# EAGLE schematic ECU-V1.3 (EAGLE 7.6.0)

## Sheet 1 of 6
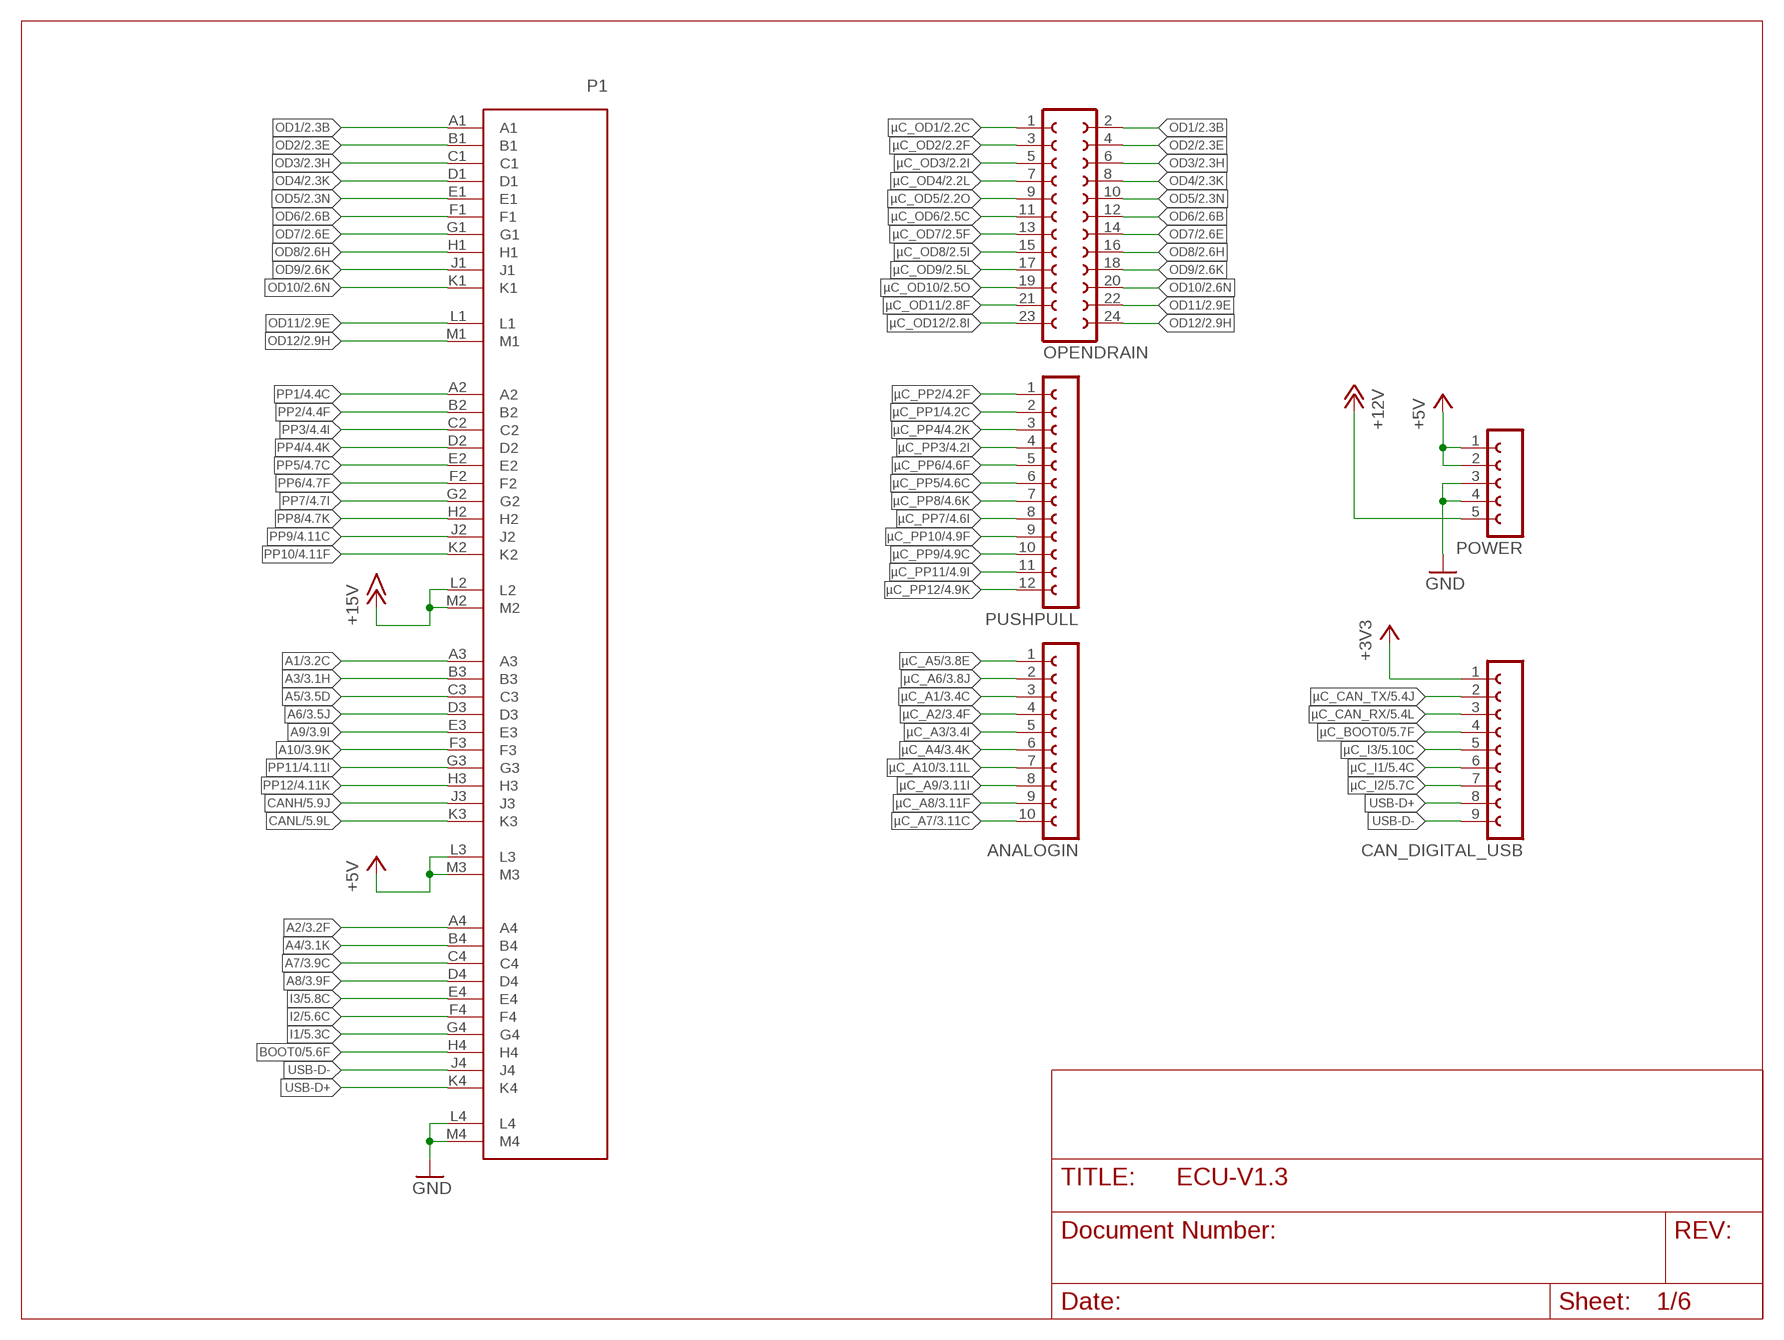
[diagram p0: schematic, sheet 1]

### Parts
ANALOGIN  FE10-1  [FE10]
CAN_DIGITAL_USB  FE09-1  [FE09]
OPENDRAIN  FE12-2  [FE12-2]
P1  ECU-CONNECTOR  [ECU-CONNECTOR]
POWER  FE05-1  [FE05-1]
PUSHPULL  FE12-1  [FE12]

### Nets
+3V3: CAN_DIGITAL_USB.1 ; also sheet 5
+5V: P1.L3 P1.M3 POWER.1 POWER.2 ; also sheet 3,4,5,6
+12V: POWER.5 ; also sheet 3,6
+15V: P1.L2 P1.M2 ; also sheet 6
A1: P1.A3 ; also sheet 3
A2: P1.A4 ; also sheet 3
A3: P1.B3 ; also sheet 3
A4: P1.B4 ; also sheet 3
A5: P1.C3 ; also sheet 3
A6: P1.D3 ; also sheet 3
A7: P1.C4 ; also sheet 3
A8: P1.D4 ; also sheet 3
A9: P1.E3 ; also sheet 3
A10: P1.F3 ; also sheet 3
BOOT0: P1.H4 ; also sheet 5
CANH: P1.J3 ; also sheet 5
CANL: P1.K3 ; also sheet 5
GND: P1.L4 P1.M4 POWER.3 POWER.4 ; also sheet 2,3,4,5,6
I1: P1.G4 ; also sheet 5
I2: P1.F4 ; also sheet 5
I3: P1.E4 ; also sheet 5
OD1: OPENDRAIN.2 P1.A1 ; also sheet 2
OD2: OPENDRAIN.4 P1.B1 ; also sheet 2
OD3: OPENDRAIN.6 P1.C1 ; also sheet 2
OD4: OPENDRAIN.8 P1.D1 ; also sheet 2
OD5: OPENDRAIN.10 P1.E1 ; also sheet 2
OD6: OPENDRAIN.12 P1.F1 ; also sheet 2
OD7: OPENDRAIN.14 P1.G1 ; also sheet 2
OD8: OPENDRAIN.16 P1.H1 ; also sheet 2
OD9: OPENDRAIN.18 P1.J1 ; also sheet 2
OD10: OPENDRAIN.20 P1.K1 ; also sheet 2
OD11: OPENDRAIN.22 P1.L1 ; also sheet 2
OD12: OPENDRAIN.24 P1.M1 ; also sheet 2
PP1: P1.A2 ; also sheet 4
PP2: P1.B2 ; also sheet 4
PP3: P1.C2 ; also sheet 4
PP4: P1.D2 ; also sheet 4
PP5: P1.E2 ; also sheet 4
PP6: P1.F2 ; also sheet 4
PP7: P1.G2 ; also sheet 4
PP8: P1.H2 ; also sheet 4
PP9: P1.J2 ; also sheet 4
PP10: P1.K2 ; also sheet 4
PP11: P1.G3 ; also sheet 4
PP12: P1.H3 ; also sheet 4
USB-D+: CAN_DIGITAL_USB.8 P1.K4
USB-D-: CAN_DIGITAL_USB.9 P1.J4
µC_A1: ANALOGIN.3 ; also sheet 3
µC_A2: ANALOGIN.4 ; also sheet 3
µC_A3: ANALOGIN.5 ; also sheet 3
µC_A4: ANALOGIN.6 ; also sheet 3
µC_A5: ANALOGIN.1 ; also sheet 3
µC_A6: ANALOGIN.2 ; also sheet 3
µC_A7: ANALOGIN.10 ; also sheet 3
µC_A8: ANALOGIN.9 ; also sheet 3
µC_A9: ANALOGIN.8 ; also sheet 3
µC_A10: ANALOGIN.7 ; also sheet 3
µC_BOOT0: CAN_DIGITAL_USB.4 ; also sheet 5
µC_CAN_RX: CAN_DIGITAL_USB.3 ; also sheet 5
µC_CAN_TX: CAN_DIGITAL_USB.2 ; also sheet 5
µC_I1: CAN_DIGITAL_USB.6 ; also sheet 5
µC_I2: CAN_DIGITAL_USB.7 ; also sheet 5
µC_I3: CAN_DIGITAL_USB.5 ; also sheet 5
µC_OD1: OPENDRAIN.1 ; also sheet 2
µC_OD2: OPENDRAIN.3 ; also sheet 2
µC_OD3: OPENDRAIN.5 ; also sheet 2
µC_OD4: OPENDRAIN.7 ; also sheet 2
µC_OD5: OPENDRAIN.9 ; also sheet 2
µC_OD6: OPENDRAIN.11 ; also sheet 2
µC_OD7: OPENDRAIN.13 ; also sheet 2
µC_OD8: OPENDRAIN.15 ; also sheet 2
µC_OD9: OPENDRAIN.17 ; also sheet 2
µC_OD10: OPENDRAIN.19 ; also sheet 2
µC_OD11: OPENDRAIN.21 ; also sheet 2
µC_OD12: OPENDRAIN.23 ; also sheet 2
µC_PP1: PUSHPULL.2 ; also sheet 4
µC_PP2: PUSHPULL.1 ; also sheet 4
µC_PP3: PUSHPULL.4 ; also sheet 4
µC_PP4: PUSHPULL.3 ; also sheet 4
µC_PP5: PUSHPULL.6 ; also sheet 4
µC_PP6: PUSHPULL.5 ; also sheet 4
µC_PP7: PUSHPULL.8 ; also sheet 4
µC_PP8: PUSHPULL.7 ; also sheet 4
µC_PP9: PUSHPULL.10 ; also sheet 4
µC_PP10: PUSHPULL.9 ; also sheet 4
µC_PP11: PUSHPULL.11 ; also sheet 4
µC_PP12: PUSHPULL.12 ; also sheet 4

## Sheet 2 of 6
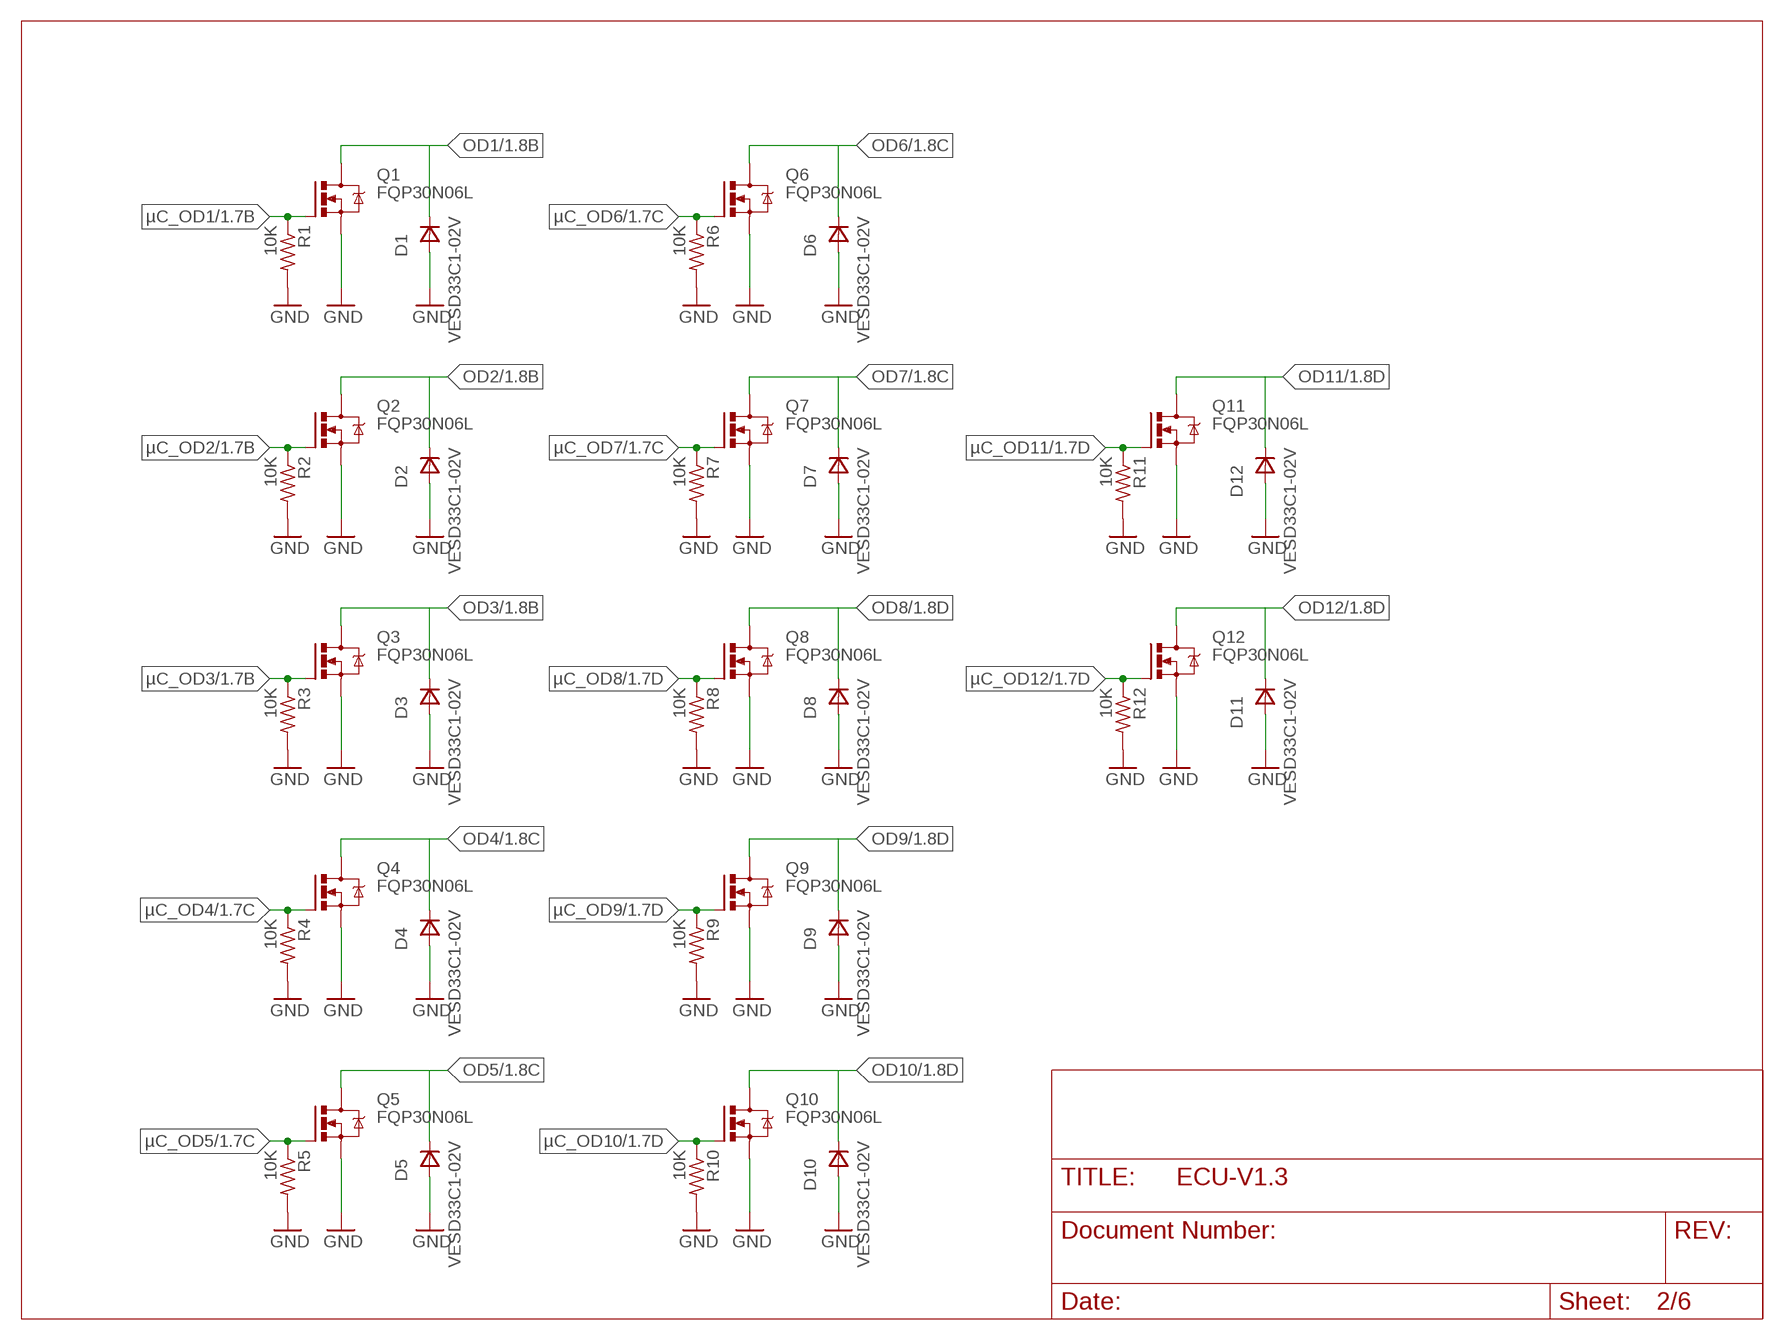
[diagram p1: schematic, sheet 2]

### Parts
D1  VESD33C1-02V  DSOD323  [SOD323]
D2  VESD33C1-02V  DSOD323  [SOD323]
D3  VESD33C1-02V  DSOD323  [SOD323]
D4  VESD33C1-02V  DSOD323  [SOD323]
D5  VESD33C1-02V  DSOD323  [SOD323]
D6  VESD33C1-02V  DSOD323  [SOD323]
D7  VESD33C1-02V  DSOD323  [SOD323]
D8  VESD33C1-02V  DSOD323  [SOD323]
D9  VESD33C1-02V  DSOD323  [SOD323]
D10  VESD33C1-02V  DSOD323  [SOD323]
D11  VESD33C1-02V  DSOD323  [SOD323]
D12  VESD33C1-02V  DSOD323  [SOD323]
Q1  FQP30N06L  [TO220BV]
Q2  FQP30N06L  [TO220BV]
Q3  FQP30N06L  [TO220BV]
Q4  FQP30N06L  [TO220BV]
Q5  FQP30N06L  [TO220BV]
Q6  FQP30N06L  [TO220BV]
Q7  FQP30N06L  [TO220BV]
Q8  FQP30N06L  [TO220BV]
Q9  FQP30N06L  [TO220BV]
Q10  FQP30N06L  [TO220BV]
Q11  FQP30N06L  [TO220BV]
Q12  FQP30N06L  [TO220BV]
R1  10K  R-US_R0805  [R0805]
R2  10K  R-US_R0805  [R0805]
R3  10K  R-US_R0805  [R0805]
R4  10K  R-US_R0805  [R0805]
R5  10K  R-US_R0805  [R0805]
R6  10K  R-US_R0805  [R0805]
R7  10K  R-US_R0805  [R0805]
R8  10K  R-US_R0805  [R0805]
R9  10K  R-US_R0805  [R0805]
R10  10K  R-US_R0805  [R0805]
R11  10K  R-US_R0805  [R0805]
R12  10K  R-US_R0805  [R0805]

### Nets
GND: D1.2(A) D2.2(A) D3.2(A) D4.2(A) D5.2(A) D6.2(A) D7.2(A) D8.2(A) D9.2(A) D10.2(A) D11.2(A) D12.2(A) Q1.S Q2.S Q3.S Q4.S Q5.S Q6.S Q7.S Q8.S Q9.S Q10.S Q11.S Q12.S R1.2 R2.2 R3.2 R4.2 R5.2 R6.2 R7.2 R8.2 R9.2 R10.2 R11.2 R12.2 ; also sheet 1,3,4,5,6
OD1: D1.1(C) Q1.D ; also sheet 1
OD2: D2.1(C) Q2.D ; also sheet 1
OD3: D3.1(C) Q3.D ; also sheet 1
OD4: D4.1(C) Q4.D ; also sheet 1
OD5: D5.1(C) Q5.D ; also sheet 1
OD6: D6.1(C) Q6.D ; also sheet 1
OD7: D7.1(C) Q7.D ; also sheet 1
OD8: D8.1(C) Q8.D ; also sheet 1
OD9: D9.1(C) Q9.D ; also sheet 1
OD10: D10.1(C) Q10.D ; also sheet 1
OD11: D12.1(C) Q11.D ; also sheet 1
OD12: D11.1(C) Q12.D ; also sheet 1
µC_OD1: Q1.G R1.1 ; also sheet 1
µC_OD2: Q2.G R2.1 ; also sheet 1
µC_OD3: Q3.G R3.1 ; also sheet 1
µC_OD4: Q4.G R4.1 ; also sheet 1
µC_OD5: Q5.G R5.1 ; also sheet 1
µC_OD6: Q6.G R6.1 ; also sheet 1
µC_OD7: Q7.G R7.1 ; also sheet 1
µC_OD8: Q8.G R8.1 ; also sheet 1
µC_OD9: Q9.G R9.1 ; also sheet 1
µC_OD10: Q10.G R10.1 ; also sheet 1
µC_OD11: Q11.G R11.1 ; also sheet 1
µC_OD12: Q12.G R12.1 ; also sheet 1

## Sheet 3 of 6
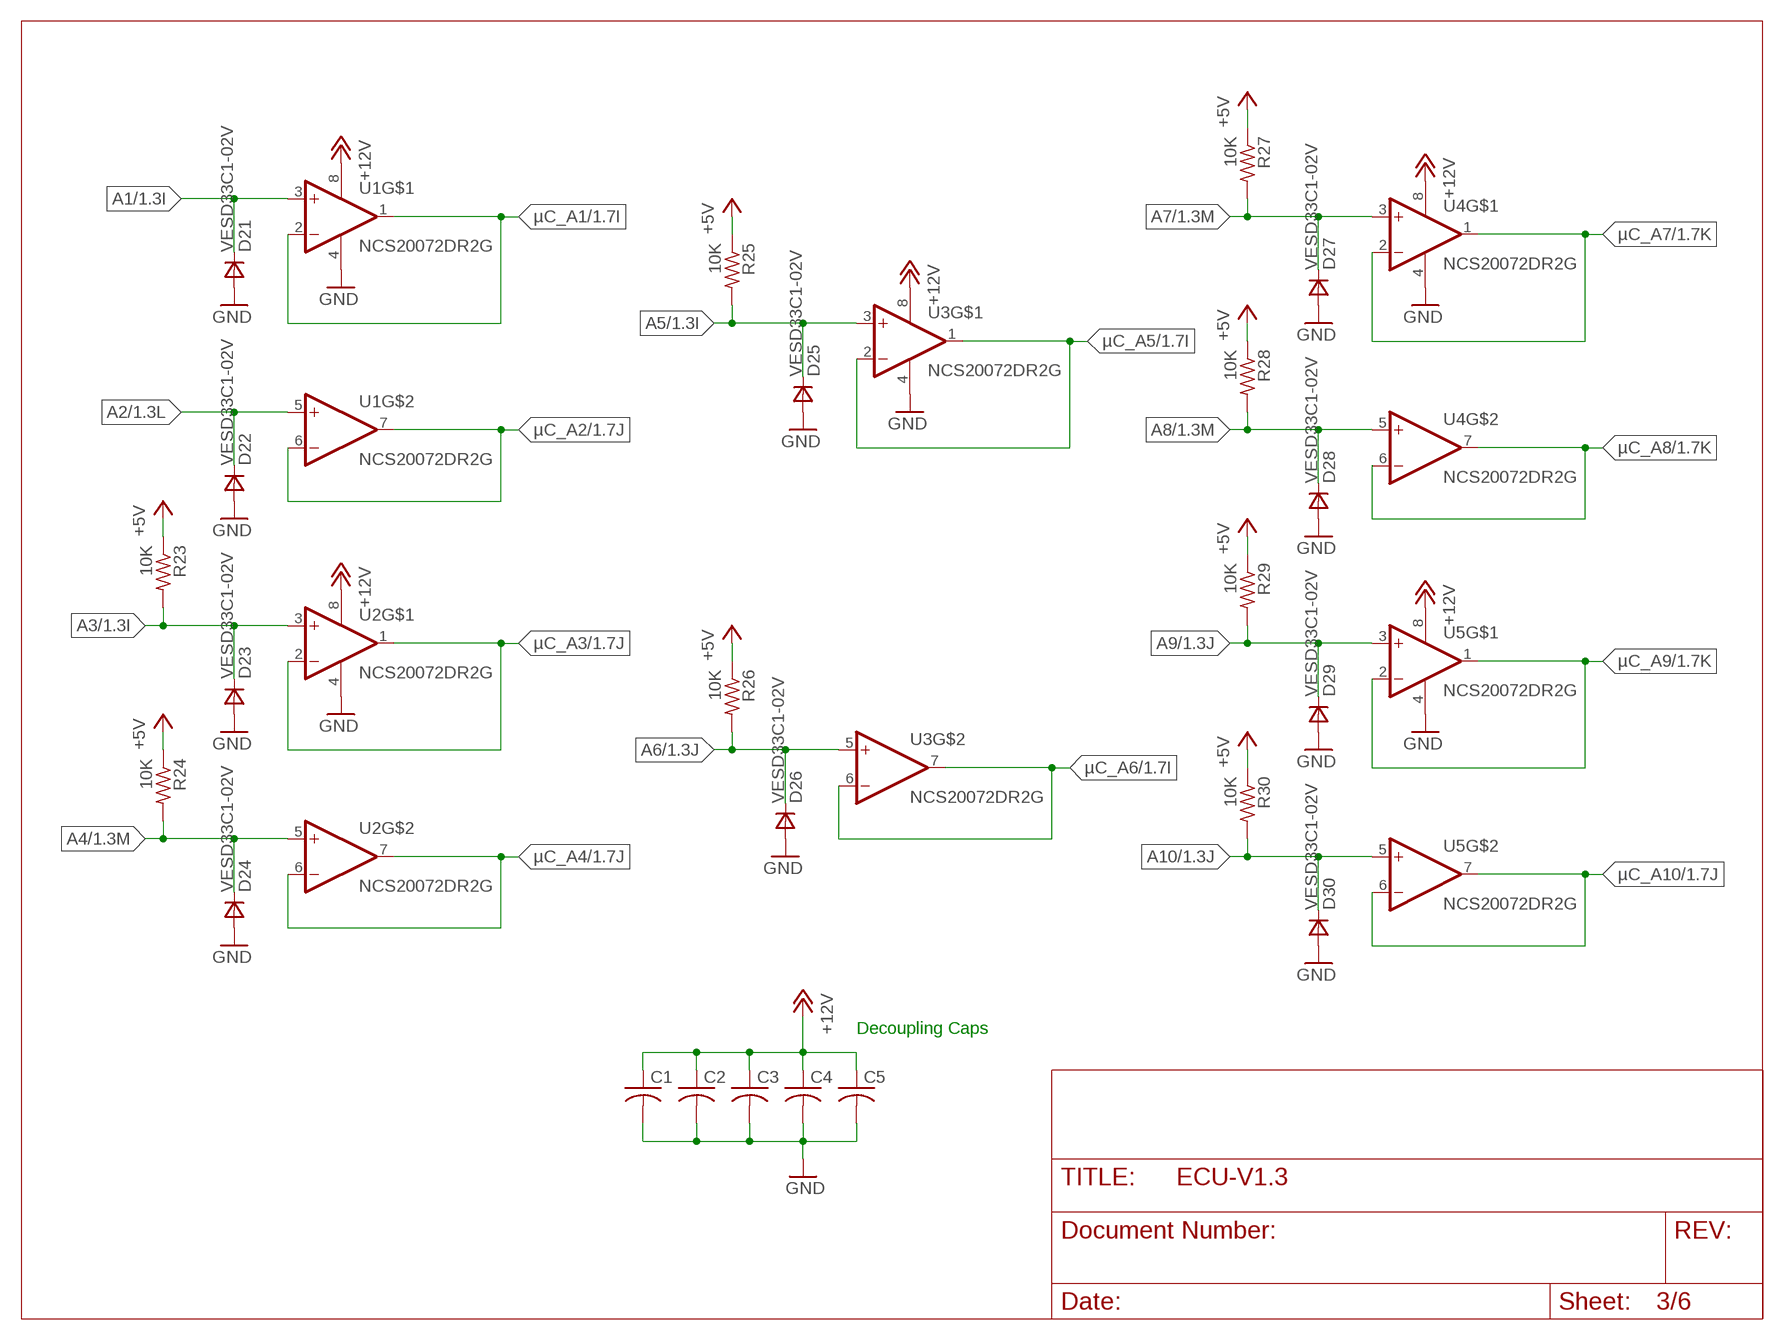
[diagram p2: schematic, sheet 3]

### Parts
C1  C-USC0805  [C0805]
C2  C-USC0805  [C0805]
C3  C-USC0805  [C0805]
C4  C-USC0805  [C0805]
C5  C-USC0805  [C0805]
D21  VESD33C1-02V  DSOD323  [SOD323]
D22  VESD33C1-02V  DSOD323  [SOD323]
D23  VESD33C1-02V  DSOD323  [SOD323]
D24  VESD33C1-02V  DSOD323  [SOD323]
D25  VESD33C1-02V  DSOD323  [SOD323]
D26  VESD33C1-02V  DSOD323  [SOD323]
D27  VESD33C1-02V  DSOD323  [SOD323]
D28  VESD33C1-02V  DSOD323  [SOD323]
D29  VESD33C1-02V  DSOD323  [SOD323]
D30  VESD33C1-02V  DSOD323  [SOD323]
R23  10K  R-US_R0805  [R0805]
R24  10K  R-US_R0805  [R0805]
R25  10K  R-US_R0805  [R0805]
R26  10K  R-US_R0805  [R0805]
R27  10K  R-US_R0805  [R0805]
R28  10K  R-US_R0805  [R0805]
R29  10K  R-US_R0805  [R0805]
R30  10K  R-US_R0805  [R0805]
U1  NCS20072DR2G  [SOIC8]
U2  NCS20072DR2G  [SOIC8]
U3  NCS20072DR2G  [SOIC8]
U4  NCS20072DR2G  [SOIC8]
U5  NCS20072DR2G  [SOIC8]

### Nets
+5V: R23.1 R24.1 R25.1 R26.1 R27.1 R28.1 R29.1 R30.1 ; also sheet 1,4,5,6
+12V: C1.1 C2.1 C3.1 C4.1 C5.1 U1.8(V+) U2.8(V+) U3.8(V+) U4.8(V+) U5.8(V+) ; also sheet 1,6
A1: D21.1(C) U1.3(+IN) ; also sheet 1
A2: D22.1(C) U1.5(+IN) ; also sheet 1
A3: D23.1(C) R23.2 U2.3(+IN) ; also sheet 1
A4: D24.1(C) R24.2 U2.5(+IN) ; also sheet 1
A5: D25.1(C) R25.2 U3.3(+IN) ; also sheet 1
A6: D26.1(C) R26.2 U3.5(+IN) ; also sheet 1
A7: D27.1(C) R27.2 U4.3(+IN) ; also sheet 1
A8: D28.1(C) R28.2 U4.5(+IN) ; also sheet 1
A9: D29.1(C) R29.2 U5.3(+IN) ; also sheet 1
A10: D30.1(C) R30.2 U5.5(+IN) ; also sheet 1
GND: C1.2 C2.2 C3.2 C4.2 C5.2 D21.2(A) D22.2(A) D23.2(A) D24.2(A) D25.2(A) D26.2(A) D27.2(A) D28.2(A) D29.2(A) D30.2(A) U1.4(V-) U2.4(V-) U3.4(V-) U4.4(V-) U5.4(V-) ; also sheet 1,2,4,5,6
µC_A1: U1.1(OUT) U1.2(-IN) ; also sheet 1
µC_A2: U1.6(-IN) U1.7(OUT) ; also sheet 1
µC_A3: U2.1(OUT) U2.2(-IN) ; also sheet 1
µC_A4: U2.6(-IN) U2.7(OUT) ; also sheet 1
µC_A5: U3.1(OUT) U3.2(-IN) ; also sheet 1
µC_A6: U3.6(-IN) U3.7(OUT) ; also sheet 1
µC_A7: U4.1(OUT) U4.2(-IN) ; also sheet 1
µC_A8: U4.6(-IN) U4.7(OUT) ; also sheet 1
µC_A9: U5.1(OUT) U5.2(-IN) ; also sheet 1
µC_A10: U5.6(-IN) U5.7(OUT) ; also sheet 1

### Notes on the sheet
- Decoupling Caps

## Sheet 4 of 6
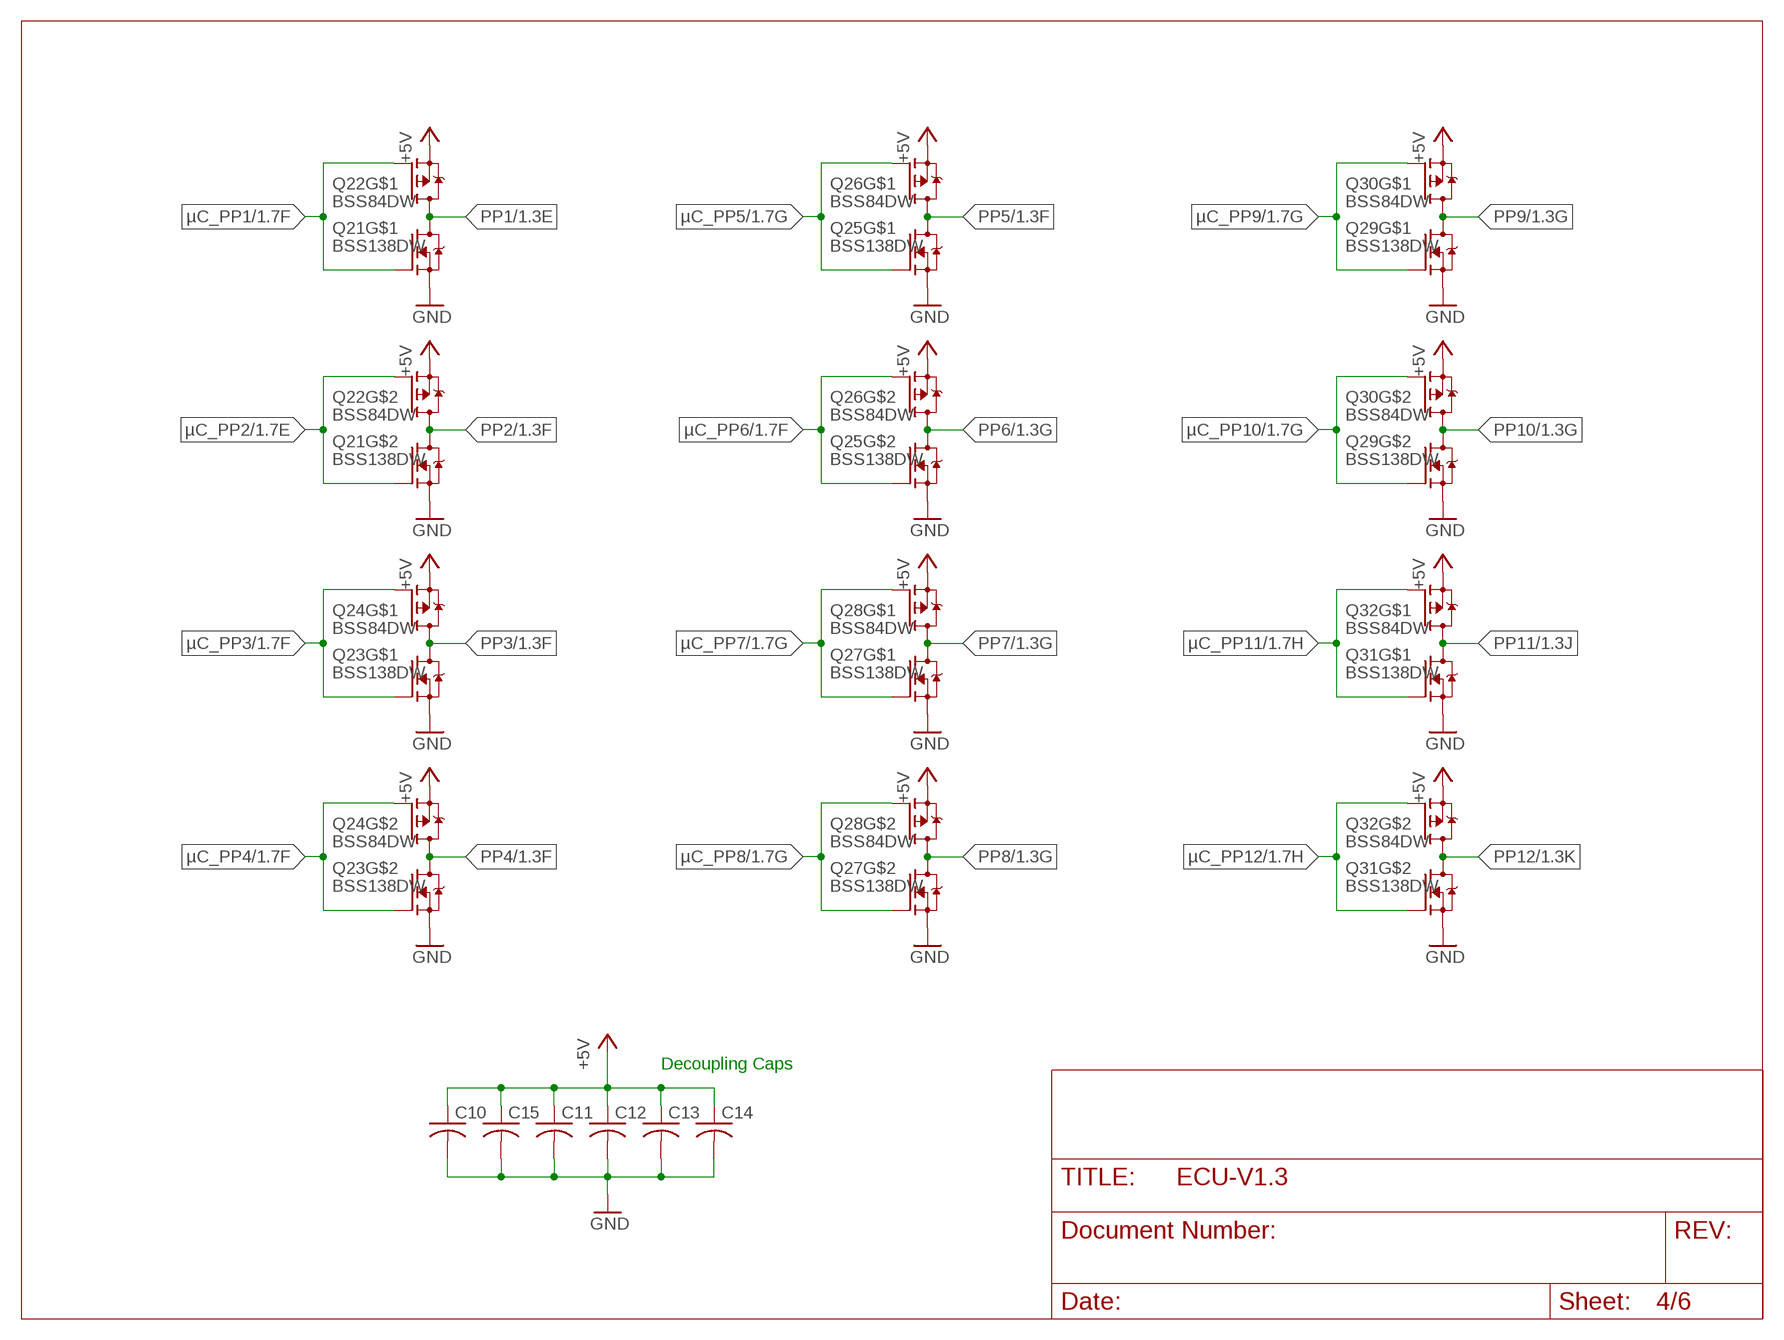
[diagram p3: schematic, sheet 4]

### Parts
C10  C-USC0805  [C0805]
C11  C-USC0805  [C0805]
C12  C-USC0805  [C0805]
C13  C-USC0805  [C0805]
C14  C-USC0805  [C0805]
C15  C-USC0805  [C0805]
Q21  BSS138DW  [SOT363_INFINEON]
Q22  BSS84DW  [SOT363_INFINEON]
Q23  BSS138DW  [SOT363_INFINEON]
Q24  BSS84DW  [SOT363_INFINEON]
Q25  BSS138DW  [SOT363_INFINEON]
Q26  BSS84DW  [SOT363_INFINEON]
Q27  BSS138DW  [SOT363_INFINEON]
Q28  BSS84DW  [SOT363_INFINEON]
Q29  BSS138DW  [SOT363_INFINEON]
Q30  BSS84DW  [SOT363_INFINEON]
Q31  BSS138DW  [SOT363_INFINEON]
Q32  BSS84DW  [SOT363_INFINEON]

### Nets
+5V: C10.1 C11.1 C12.1 C13.1 C14.1 C15.1 Q22.1(S) Q22.4(S) Q24.1(S) Q24.4(S) Q26.1(S) Q26.4(S) Q28.1(S) Q28.4(S) Q30.1(S) Q30.4(S) Q32.1(S) Q32.4(S) ; also sheet 1,3,5,6
GND: C10.2 C11.2 C12.2 C13.2 C14.2 C15.2 Q21.1(S) Q21.4(S) Q23.1(S) Q23.4(S) Q25.1(S) Q25.4(S) Q27.1(S) Q27.4(S) Q29.1(S) Q29.4(S) Q31.1(S) Q31.4(S) ; also sheet 1,2,3,5,6
PP1: Q21.3(D) Q22.3(D) ; also sheet 1
PP2: Q21.6(D) Q22.6(D) ; also sheet 1
PP3: Q23.3(D) Q24.3(D) ; also sheet 1
PP4: Q23.6(D) Q24.6(D) ; also sheet 1
PP5: Q25.3(D) Q26.3(D) ; also sheet 1
PP6: Q25.6(D) Q26.6(D) ; also sheet 1
PP7: Q27.3(D) Q28.3(D) ; also sheet 1
PP8: Q27.6(D) Q28.6(D) ; also sheet 1
PP9: Q29.3(D) Q30.3(D) ; also sheet 1
PP10: Q29.6(D) Q30.6(D) ; also sheet 1
PP11: Q31.3(D) Q32.3(D) ; also sheet 1
PP12: Q31.6(D) Q32.6(D) ; also sheet 1
µC_PP1: Q21.5(G) Q22.5(G) ; also sheet 1
µC_PP2: Q21.2(G) Q22.2(G) ; also sheet 1
µC_PP3: Q23.5(G) Q24.5(G) ; also sheet 1
µC_PP4: Q23.2(G) Q24.2(G) ; also sheet 1
µC_PP5: Q25.5(G) Q26.5(G) ; also sheet 1
µC_PP6: Q25.2(G) Q26.2(G) ; also sheet 1
µC_PP7: Q27.5(G) Q28.5(G) ; also sheet 1
µC_PP8: Q27.2(G) Q28.2(G) ; also sheet 1
µC_PP9: Q29.5(G) Q30.5(G) ; also sheet 1
µC_PP10: Q29.2(G) Q30.2(G) ; also sheet 1
µC_PP11: Q31.5(G) Q32.5(G) ; also sheet 1
µC_PP12: Q31.2(G) Q32.2(G) ; also sheet 1

### Notes on the sheet
- Decoupling Caps

## Sheet 5 of 6
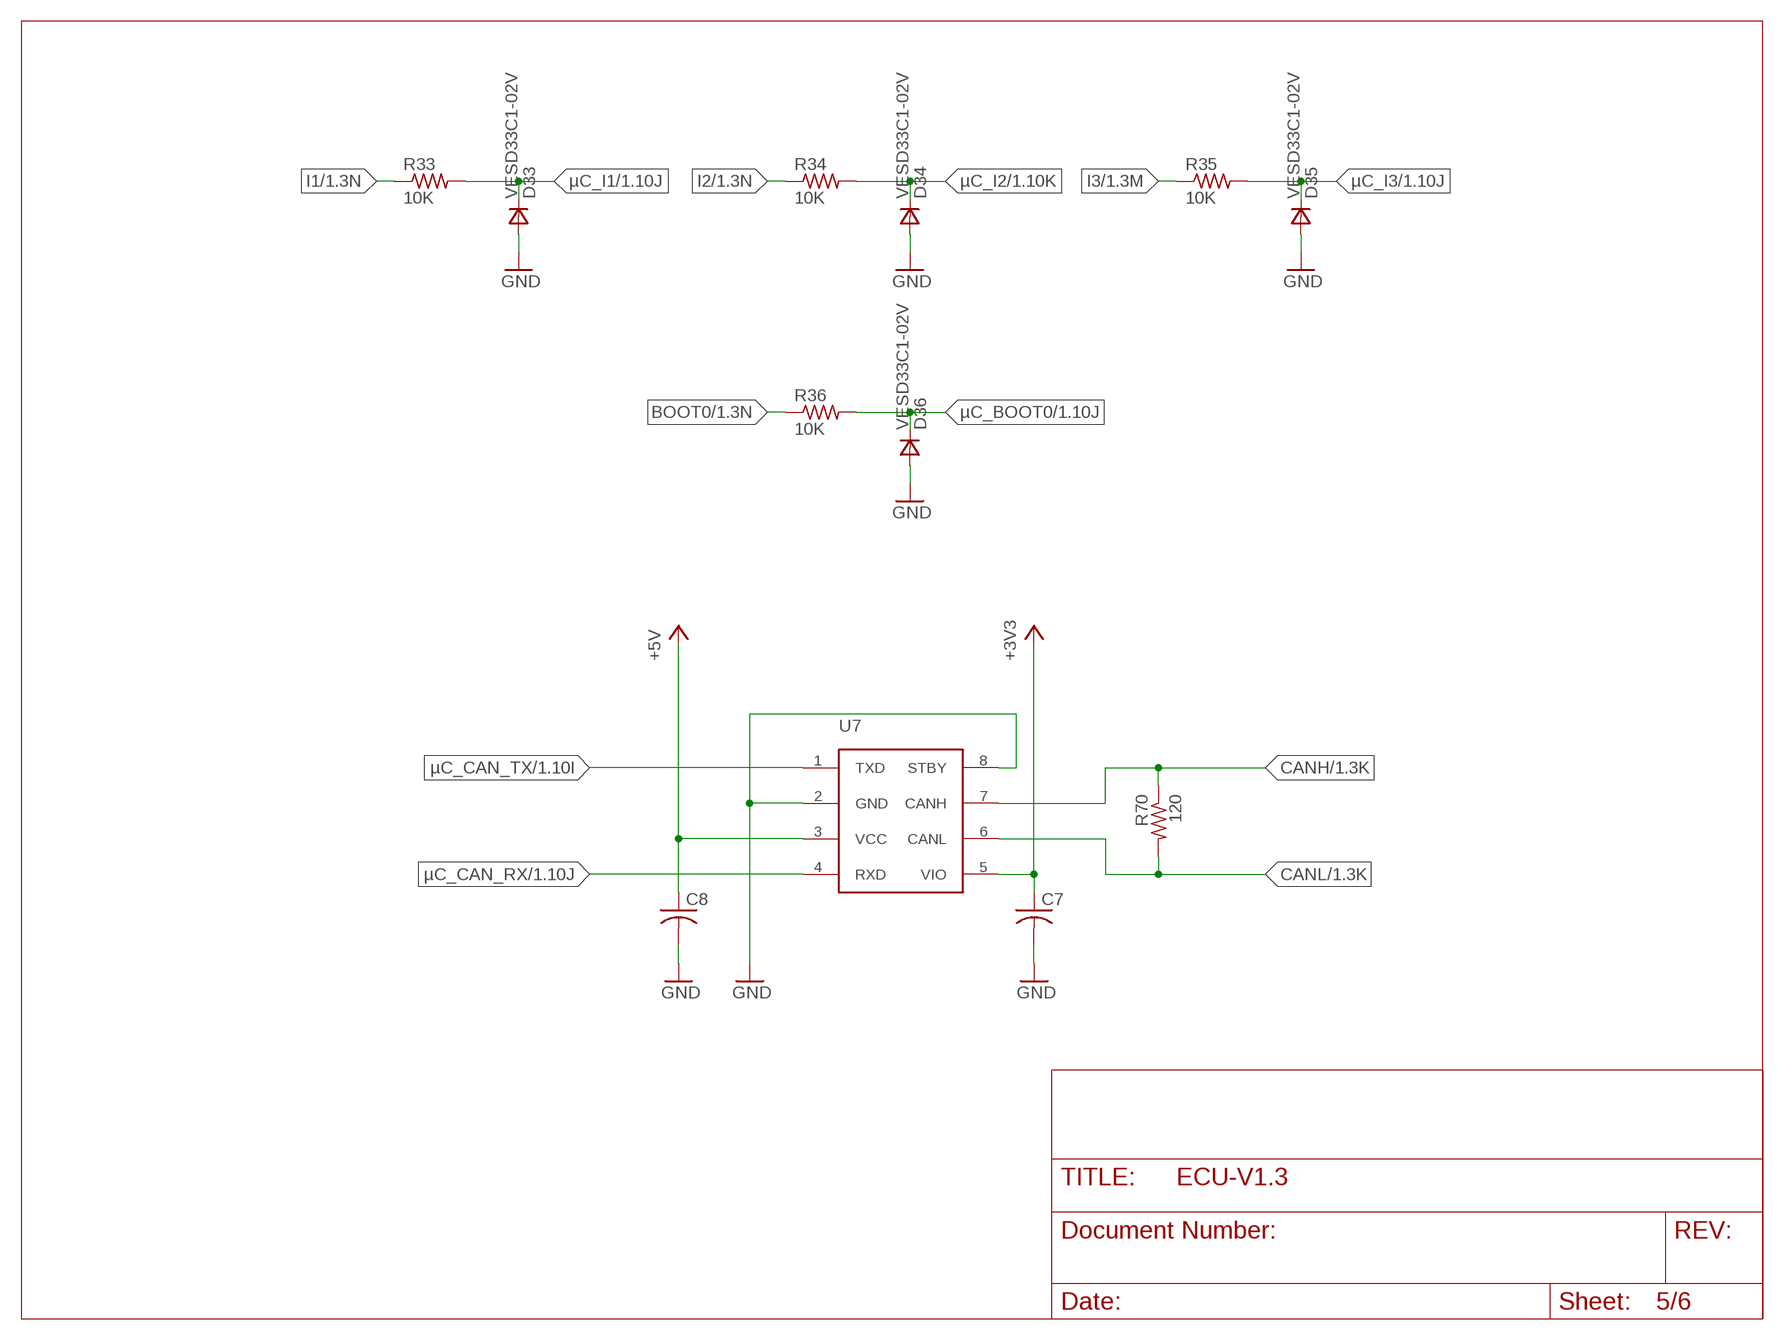
[diagram p4: schematic, sheet 5]

### Parts
C7  C-USC0805  [C0805]
C8  C-USC0805  [C0805]
D33  VESD33C1-02V  DSOD323  [SOD323]
D34  VESD33C1-02V  DSOD323  [SOD323]
D35  VESD33C1-02V  DSOD323  [SOD323]
D36  VESD33C1-02V  DSOD323  [SOD323]
R33  10K  R-US_R0805  [R0805]
R34  10K  R-US_R0805  [R0805]
R35  10K  R-US_R0805  [R0805]
R36  10K  R-US_R0805  [R0805]
R70  120  R-US_R0805  [R0805]
U7  ATA6561-GA  [SO-08]

### Nets
+3V3: C7.1 U7.5(VIO) ; also sheet 1
+5V: C8.1 U7.3(VCC) ; also sheet 1,3,4,6
BOOT0: R36.1 ; also sheet 1
CANH: R70.1 U7.7(CANH) ; also sheet 1
CANL: R70.2 U7.6(CANL) ; also sheet 1
GND: C7.2 C8.2 D33.2(A) D34.2(A) D35.2(A) D36.2(A) U7.2(GND) U7.8(STBY) ; also sheet 1,2,3,4,6
I1: R33.1 ; also sheet 1
I2: R34.1 ; also sheet 1
I3: R35.1 ; also sheet 1
µC_BOOT0: D36.1(C) R36.2 ; also sheet 1
µC_CAN_RX: U7.4(RXD) ; also sheet 1
µC_CAN_TX: U7.1(TXD) ; also sheet 1
µC_I1: D33.1(C) R33.2 ; also sheet 1
µC_I2: D34.1(C) R34.2 ; also sheet 1
µC_I3: D35.1(C) R35.2 ; also sheet 1

## Sheet 6 of 6
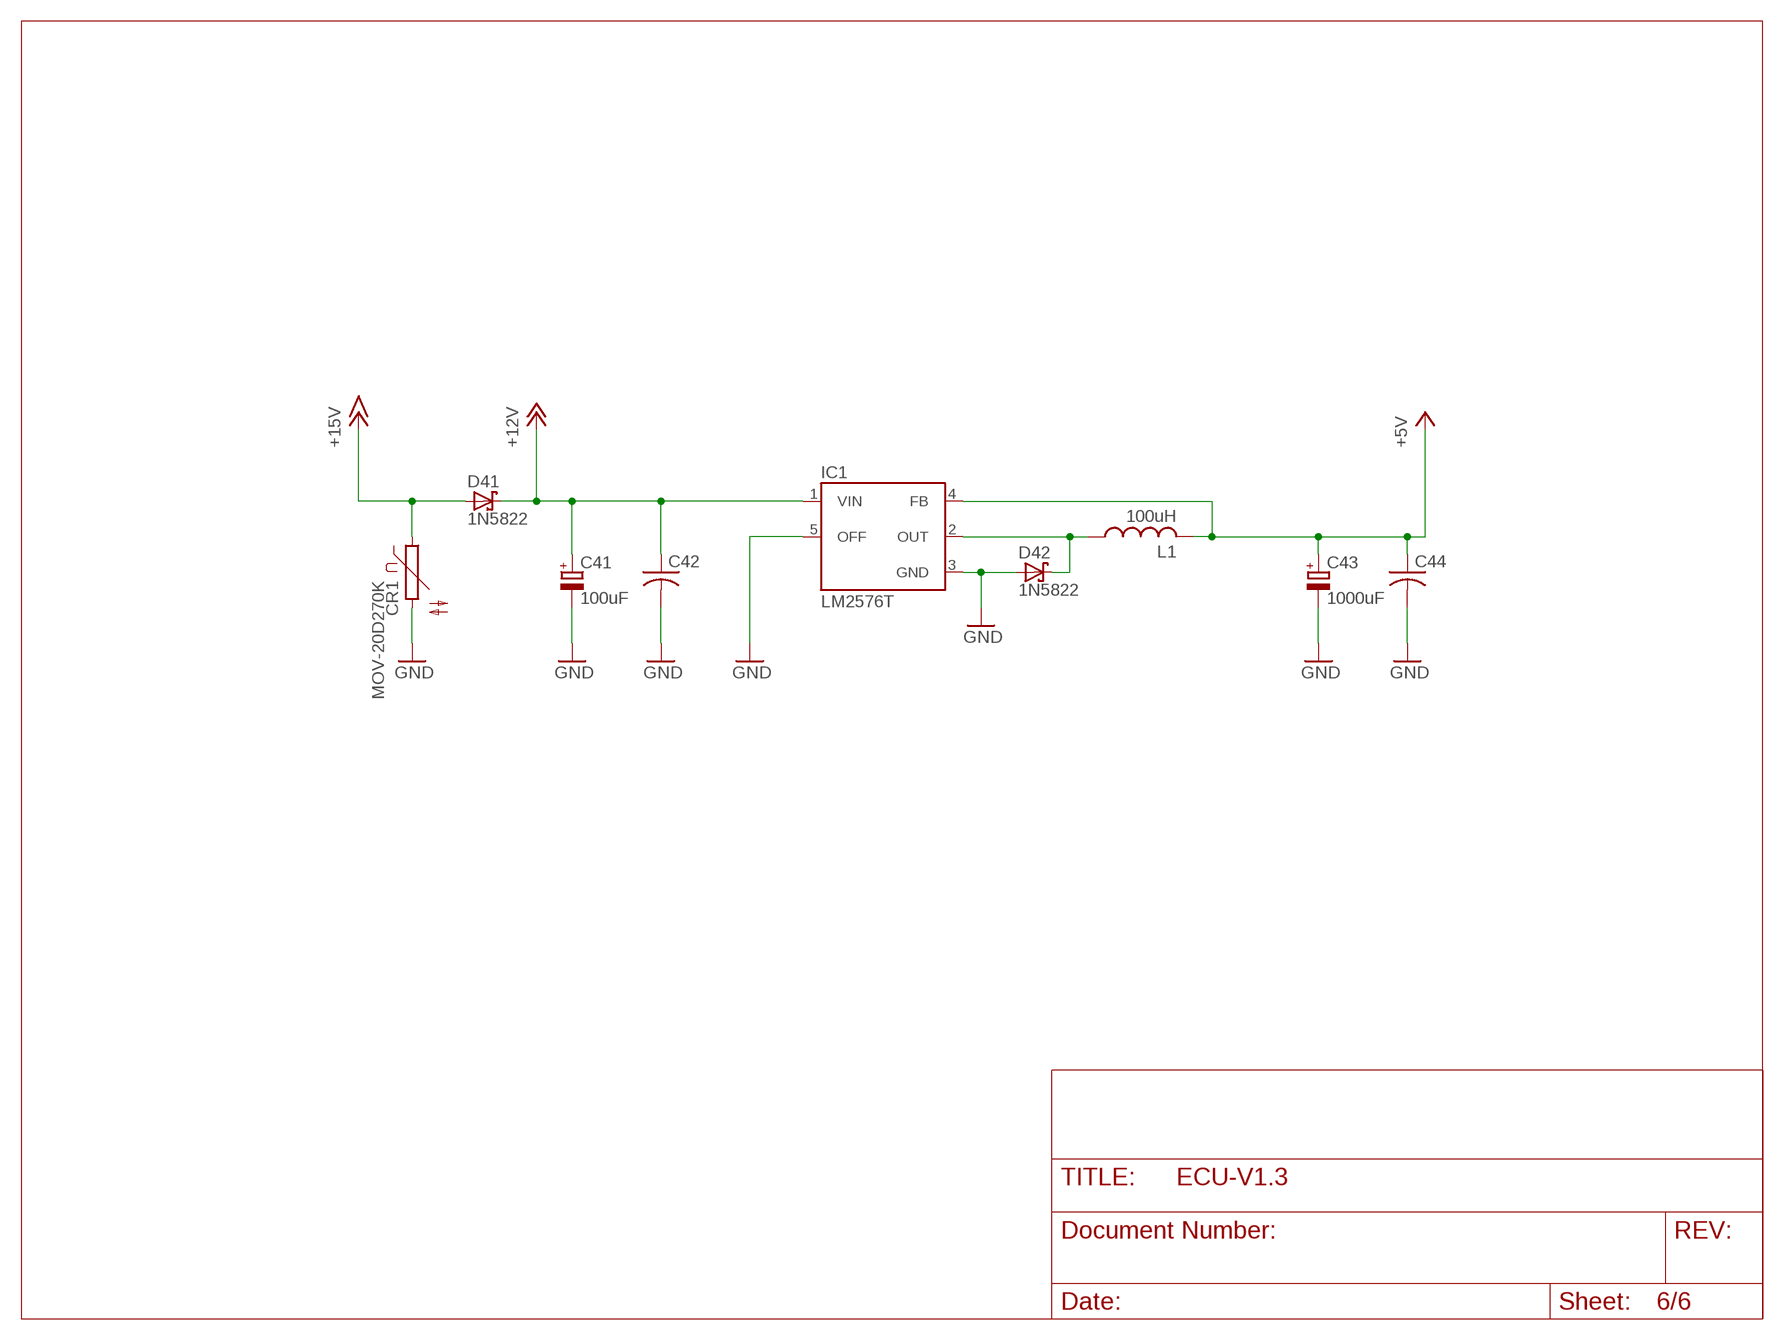
[diagram p5: schematic, sheet 6]

### Parts
C41  100uF  CPOL-EUE3.5-10  [E3,5-10]
C42  C-USC0805  [C0805]
C43  1000uF  CPOL-EUE3.5-10  [E3,5-10]
C44  C-USC0805  [C0805]
CR1  MOV-20D270K  S14K40  [S14K40]
D41  1N5822  SCHOTTKY-DIODEDO35-7  [DIODE_DO35-7]
D42  1N5822  SCHOTTKY-DIODEDO35-7  [DIODE_DO35-7]
IC1  LM2576T  [TO220-5]
L1  100uH  L-US6000-XXX-RC  [6000-XXXX-RC]

### Nets
+5V: C43.+ C44.1 IC1.4(FB) L1.2 ; also sheet 1,3,4,5
+12V: C41.+ C42.1 D41.C(A) IC1.1(VIN) ; also sheet 1,3
+15V: CR1.1 D41.A(C) ; also sheet 1
GND: C41.- C42.2 C43.- C44.2 CR1.2 D42.A(C) IC1.3(GND) IC1.5(OFF) ; also sheet 1,2,3,4,5
N$77: D42.C(A) IC1.2(OUT) L1.1

## Library data of the parts
ANALOGIN = con-lsta:FE10-1: FEMALE HEADER; OC_FARNELL: unknown; OC_NEWARK: unknown
C1-C5 C7 C8 C10-C15 C42 C44 = rcl:C-US: CAPACITOR, American symbol
C41 C43 = resistor:CPOL-EU: POLARIZED CAPACITOR, European symbol
CAN_DIGITAL_USB = con-lsta:FE09-1: FEMALE HEADER; OC_FARNELL: unknown; OC_NEWARK: unknown
CR1 = varistor:S14K40: VARISTOR
D1-D12 D21-D30 D33-D36 = zetex:D: DIODE; MPN: CDSOD323-T05C; OC_FARNELL: 1824860; OC_NEWARK: 79R6078
D41 D42 = eagle-ltspice:SCHOTTKY-DIODE: Schottky Diode; SPICEMODEL: NONE; SPICEPREFIX: D; SPICETYPE: diode
IC1 = v-reg-3:LM2576: National Semiconductor <http://www.national.com> 3.0A "Simple Switcher"(c) 52kHz, Vout 1.23-37V (HV: 57V), Vin 40V (HV: 60V), 50µA standby current
L1 = rcl:L-US: INDUCTOR, American symbol
OPENDRAIN = con-lsta:FE12-2: FEMALE HEADER; OC_FARNELL: unknown; OC_NEWARK: unknown
P1 = ECUConnector:ECU-CONNECTOR
POWER = con-lsta:FE05-1: FEMALE HEADER; OC_FARNELL: unknown; OC_NEWARK: unknown
PUSHPULL = con-lsta:FE12-1: FEMALE HEADER; OC_FARNELL: unknown; OC_NEWARK: unknown
Q1-Q12 = transistor-power:FQP30N06L: N-CHANNEL MOS FET
Q21 Q23 Q25 Q27 Q29 Q31 = transistor-fet:BSS138DW
Q22 Q24 Q26 Q28 Q30 Q32 = transistor-fet:BSS84DW
R1-R12 R23-R30 R33-R36 R70 = resistor:R-US_: RESISTOR, American symbol
U1-U5 = linear:NCS20072
U7 = microchip:ATA6561-GA